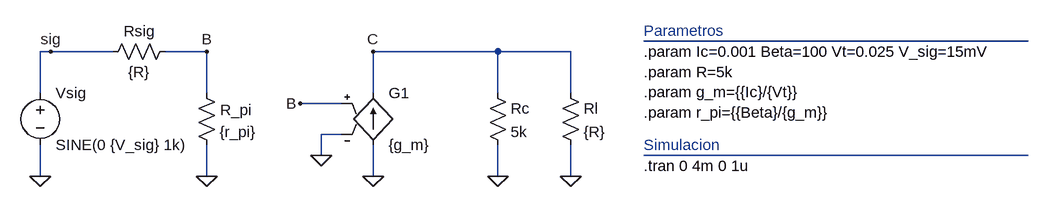
[diagram p0: schematic EC_ejemplo1_parte2.asc]
EC_ejemplo1_parte2.asc, the LTspice schematic file:
Version 4
SHEET 1 1220 680
WIRE 928 -112 336 -112
WIRE -576 -96 -592 -96
WIRE -480 -96 -576 -96
WIRE -336 -96 -400 -96
WIRE 112 -96 -80 -96
WIRE 224 -96 112 -96
WIRE -592 -32 -592 -96
WIRE -336 -32 -336 -96
WIRE -80 -32 -80 -96
WIRE 112 -32 112 -96
WIRE 224 -32 224 -96
WIRE -128 -16 -192 -16
WIRE -128 32 -160 32
WIRE -160 64 -160 32
WIRE 928 64 336 64
WIRE -592 96 -592 48
WIRE -336 96 -336 48
WIRE -80 96 -80 48
WIRE 112 96 112 48
WIRE 224 96 224 48
FLAG -592 96 0
FLAG -336 96 0
FLAG -80 96 0
FLAG 112 96 0
FLAG -336 -96 B
FLAG -80 -96 C
FLAG -192 -16 B
FLAG -160 64 0
FLAG -576 -96 sig
FLAG 224 96 0
SYMBOL voltage -592 -48 R0
WINDOW 123 0 0 Left 0
WINDOW 39 0 0 Left 0
SYMATTR InstName Vsig
SYMATTR Value SINE(0 {V_sig} 1k)
SYMBOL res -352 -48 R0
WINDOW 0 37 42 Left 2
SYMATTR InstName R_pi
SYMATTR Value {r_pi}
SYMBOL g -80 -48 R0
SYMATTR InstName G1
SYMATTR Value {g_m}
SYMBOL res 96 -48 R0
SYMATTR InstName Rc
SYMATTR Value 5k
SYMBOL res -496 -80 R270
WINDOW 0 32 56 VTop 2
WINDOW 3 0 56 VBottom 2
SYMATTR InstName Rsig
SYMATTR Value {R}
SYMBOL res 208 -48 R0
SYMATTR InstName Rl
SYMATTR Value {R}
TEXT 336 -96 Left 2 !.param Ic=0.001 Beta=100 Vt=0.025 V_sig=15mV\n.param R=5k\n.param g_m={{Ic}/{Vt}}\n.param r_pi={{Beta}/{g_m}}
TEXT 336 80 Left 2 !.tran 0 4m 0 1u
TEXT 336 -128 Left 2 ;Parametros
TEXT 336 48 Left 2 ;Simulacion

The netlist it stands for:
* EC_ejemplo1_parte2.asc
Vsig sig 0 SINE(0 {V_sig} 1k)
R_pi B 0 {r_pi}
G1 0 C B 0 {g_m}
Rc C 0 5k
Rsig sig B {R}
Rl C 0 {R}
.param Ic=0.001 Beta=100 Vt=0.025 V_sig=15mV
.param R=5k
.param g_m={{Ic}/{Vt}}
.param r_pi={{Beta}/{g_m}}
.tran 0 4m 0 1u
* Parametros
* Simulacion
.backanno
.end